# EAGLE schematic cannaster (EAGLE 9.6.2)
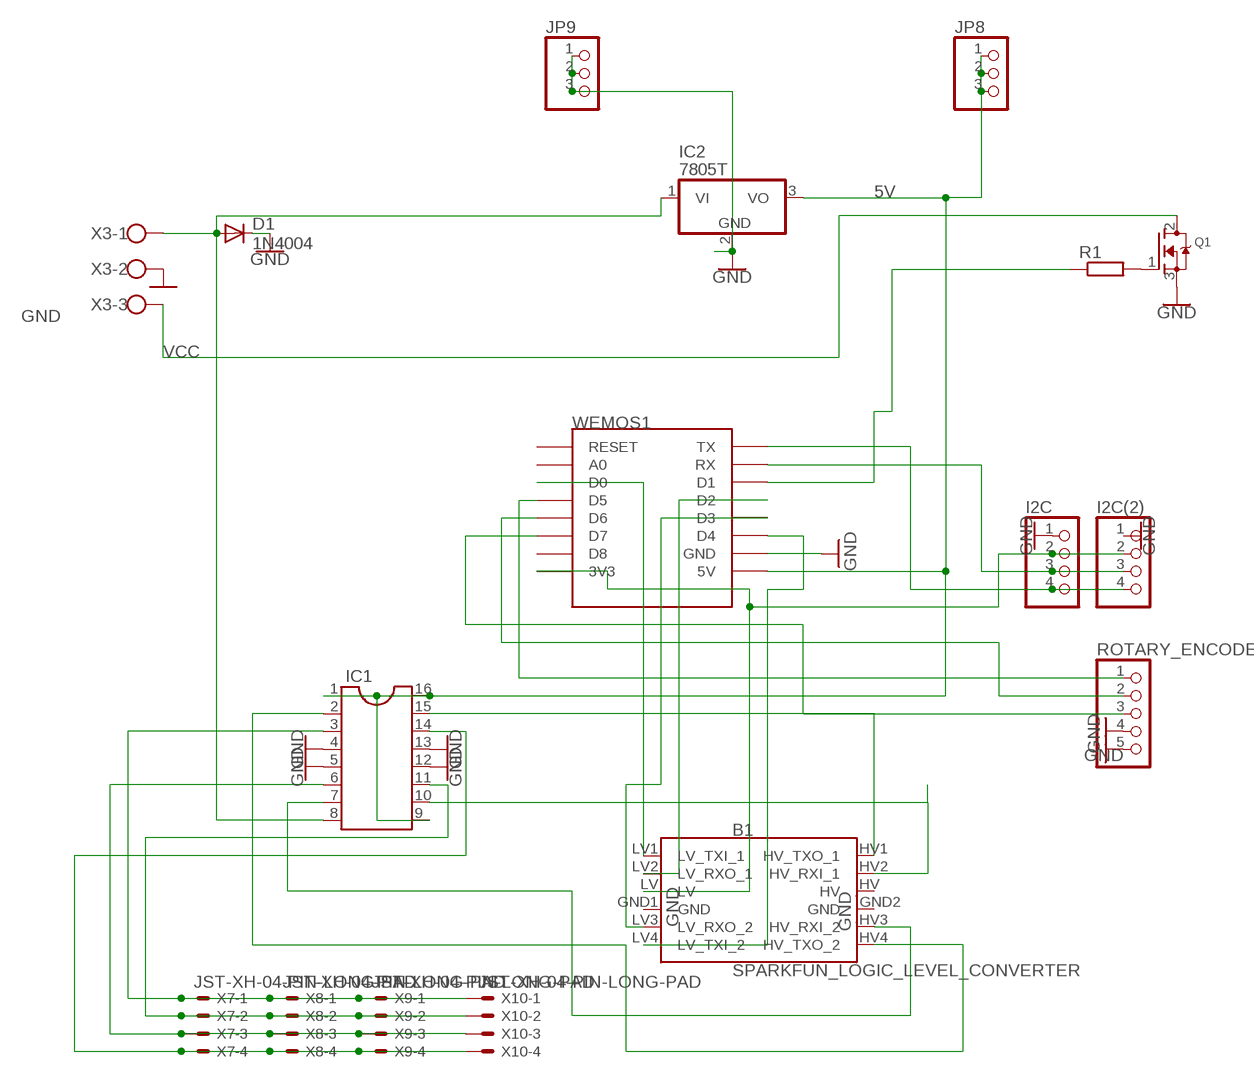
[diagram p0: schematic, sheet 1]

## Parts
B1  SPARKFUN_LOGIC_LEVEL_CONVERTER  [SPARKFUN_LOGIC_LEVEL_CONVERTER]
D1  1N4004  [DO41-10]
I2C  PINHD-1X4  [1X04]
I2C(2)  PINHD-1X4  [1X04]
IC1  DIL16  [DIL16]
IC2  7805T  [TO220H]
JP8  PINHD-1X3  [1X03]
JP9  PINHD-1X3  [1X03]
Q1  MOSFET-NGDS_TO220V  [TO220V]
R1  R-EU_0207/7  [0207/7]
ROTARY_ENCODER  PINHD-1X5  [1X05]
WEMOS1  WEMOS-D1-MINI  [WEMOS-D1-MINI]
X3  W237-103  [W237-103]
X7  JST-XH-04-PIN-LONG-PAD  [JST-XH-04-PACKAGE-LONG-PAD]
X8  JST-XH-04-PIN-LONG-PAD  [JST-XH-04-PACKAGE-LONG-PAD]
X9  JST-XH-04-PIN-LONG-PAD  [JST-XH-04-PACKAGE-LONG-PAD]
X10  JST-XH-04-PIN-LONG-PAD  [JST-XH-04-PACKAGE-LONG-PAD]

## Nets
5V: IC1.1 IC1.9 IC1.16 IC2.3(VO) JP8.1 JP8.2 JP8.3 WEMOS1.5V
GND: B1.GND1(GND) B1.GND2(GND) D1.C I2C(2).1 I2C.1 IC1.4 IC1.5 IC1.12 IC1.13 IC2.2(GND) JP9.1 JP9.2 JP9.3 Q1.3(S) ROTARY_ENCODER.4 ROTARY_ENCODER.5 WEMOS1.GND X3.2
N$1: IC1.3 X7.1 X8.1 X9.1 X10.1
N$2: IC1.11 X7.2 X8.2 X9.2 X10.2
N$3: B1.HV1(HV_TXO_1) IC1.15
N$4: IC1.14 X7.4 X8.4 X9.4 X10.4
N$5: B1.LV1(LV_TXI_1) WEMOS1.D0
N$6: Q1.2(D) X3.3
N$7: I2C(2).4 I2C.4 WEMOS1.TX
N$8: I2C(2).3 I2C.3 WEMOS1.RX
N$9: B1.LV2(LV_RXO_1) WEMOS1.D2
N$10: Q1.1(G) R1.2
N$11: B1.LV3(LV_RXO_2) WEMOS1.D3
N$12: B1.LV4(LV_TXI_2) WEMOS1.D4
N$13: ROTARY_ENCODER.1 WEMOS1.D5
N$14: ROTARY_ENCODER.2 WEMOS1.D6
N$15: ROTARY_ENCODER.3 WEMOS1.D7
N$16: R1.1 WEMOS1.D1
N$17: B1.LV I2C(2).2 I2C.2 WEMOS1.3V3
N$18: B1.HV2(HV_RXI_1) IC1.10
N$19: B1.HV3(HV_RXI_2) IC1.7
N$20: B1.HV4(HV_TXO_2) IC1.2
N$23: IC1.6 X7.3 X8.3 X9.3 X10.3
VCC: D1.A IC1.8 IC2.1(VI) X3.1
Unconnected: WEMOS1.A0 WEMOS1.D8 WEMOS1.RESET

## Power pins joined to a net without a drawn wire
HV: B1.HV

## Library data of the parts
B1 = SparkFun-Boards:SPARKFUN_LOGIC_LEVEL_CONVERTER: SparkFun Logic Level Converter -Bi-Directional This is the mechnical outline for the 3.3V - 5V bi directional logic level converter. *Note, the "LOCK" Package has the header pins staggered by an offset of 5 mils (off center line), so that when you slide a row of standard 0.1" headers into the PTH pads, it will hold position vertically. See the follwing turorial for more information on this type of special footprints: Sneaky Footprints <https://www.sparkfun.com/tutorials/114> SparkFun Products: SparkFun Logic Level Converter - Bi-Directional <https://www.sparkfun.com/products/12009>
D1 = adafruit:1N4004: DIODE General purpose 1N400x type rectifier (With bigger pads) http://www.ladyada.net/library/pcb/eaglelibrary.html
I2C I2C(2) = pinhead:PINHD-1X4: PIN HEADER
IC1 = ic-package:DIL16: Dual In Line / Socket
IC2 = adafruit:78*: Positive VOLTAGE REGULATOR Added bigger pads to the TO-92 package
JP8 JP9 = adafruit:PINHD-1X3: PIN HEADER
Q1 = adafruit:MOSFET-N: N-Channel Mosfet 2N7002E - 60V 260mA SOT23 [Digikey: 2N7002ET1GOSTR-ND] - REEL BSH103 - 30V 850mA SOT23 [Digikey: 568-5013-1-ND]
R1 = rcl:R-EU_: RESISTOR, European symbol; SPICEPREFIX: R
ROTARY_ENCODER = pinhead:PINHD-1X5: PIN HEADER
WEMOS1 = esp8266modules:WEMOS-D1-MINI: WeMos.cc D1 mini ESP8266 module
X3 = con-wago-500:W237-103: WAGO SCREW CLAMP; MPN: 237-103; OC_FARNELL: unknown; OC_NEWARK: 18M7116
X7-X10 = Rembrandt Electronics - JST XH Connectors v1-0:JST-XH-04-PIN: JST XH Connector 2 Pin Wire to board connector. Pitch: 2,54 mm, (0.100") Number of pins: 4 Created by Rembrandt Electronics www.rembrandtelectronics.com